# EAGLE design RFID-ArduinoBreakoutBoard (EAGLE 7.1.0)
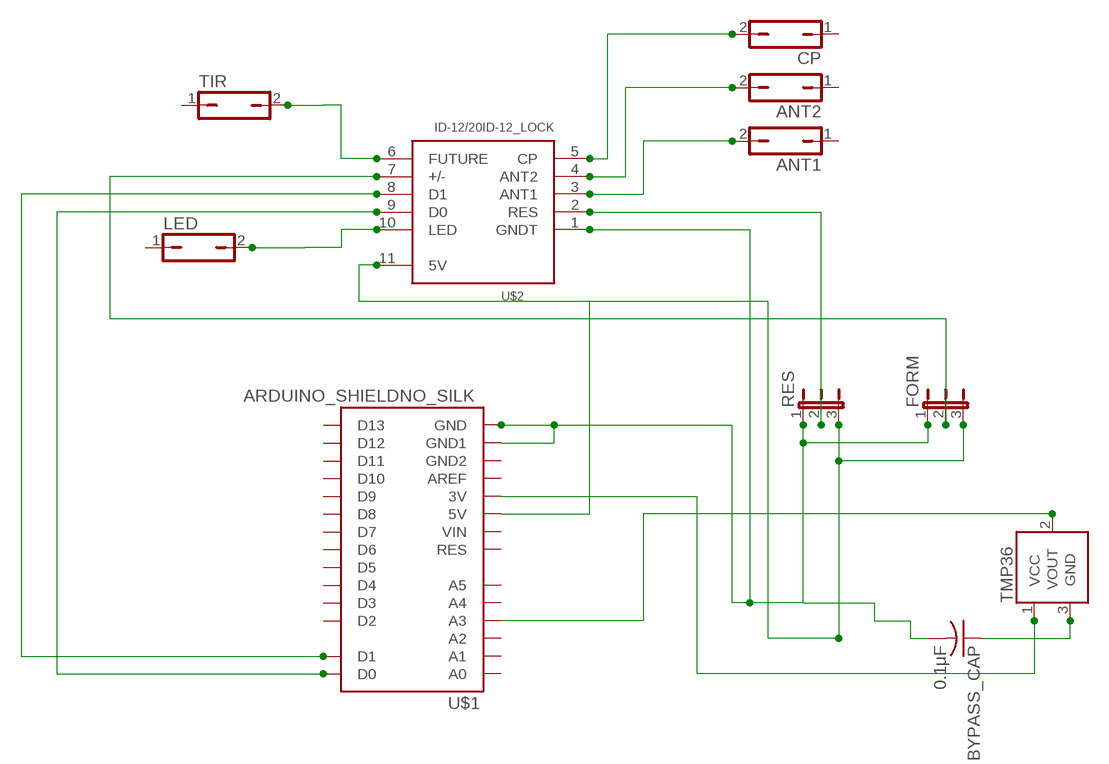
[diagram p0: schematic, sheet 1]

## Parts
ANT1  JP1Q  [JP1]
ANT2  JP1Q  [JP1]
BYPASS_CAP  0.1μF  C-USC0805  [C0805]
CP  JP1Q  [JP1]
FORM  JP2W  [JP2W]
LED  JP1Q  [JP1]
RES  JP2W  [JP2W]
TIR  JP1Q  [JP1]
TMP36  TMP36GT9  [TO-92]
U$1  ARDUINO_SHIELDNO_SILK  [DUEMILANOVE_VIAS]
U$2  ID-12/20ID-12_LOCK  [ID-12_LOCK]

## Nets
5V: FORM.3 RES.3 U$1.5V U$2.11(5V)
D0: U$1.D0 U$2.9(D0)
GND: BYPASS_CAP.2 FORM.1 RES.1 U$1.GND U$1.GND1 U$2.1(GNDT)
N$1: TMP36.2(VOUT) U$1.A3
N$2: U$1.D1 U$2.8(D1)
N$3: TMP36.1(VCC) U$1.3.3V(3V)
N$4: BYPASS_CAP.1 TMP36.3(GND)
RFID_ANT1: ANT1.2 U$2.3(ANT1)
RFID_ANT2: ANT2.2 U$2.4(ANT2)
RFID_CP: CP.2 U$2.5(CP)
RFID_FORM: FORM.2 U$2.7(+/-)
RFID_FUTURE: TIR.2 U$2.6(FUTURE)
RFID_LED: LED.2 U$2.10(LED)
RFID_RESET: RES.2 U$2.2(RES)
Unconnected: ANT1.1 ANT2.1 CP.1 LED.1 TIR.1 U$1.A0 U$1.A1 U$1.A2 U$1.A4 U$1.A5 U$1.AREF U$1.D2 U$1.D3 U$1.D4 U$1.D5 U$1.D6 U$1.D7 U$1.D8 U$1.D9 U$1.D10 U$1.D11 U$1.D12 U$1.D13 U$1.GND2 U$1.RES U$1.VIN

## Library data of the parts
ANT1 ANT2 CP LED TIR = ausbla01:JP1Q: JUMPER
BYPASS_CAP = resistor:C-US: CAPACITOR, American symbol
FORM RES = jumper:JP2W: JUMPER
TMP36 = SparkFun-Sensors:TMP36: Precision degC temp sensor, analog out
U$1 = SparkFun-Boards:ARDUINO_SHIELD: Arduino shield footprint
U$2 = SparkFun-RF:ID-12/20: RFID reader for ID2, ID12, and ID20 Package

## Board
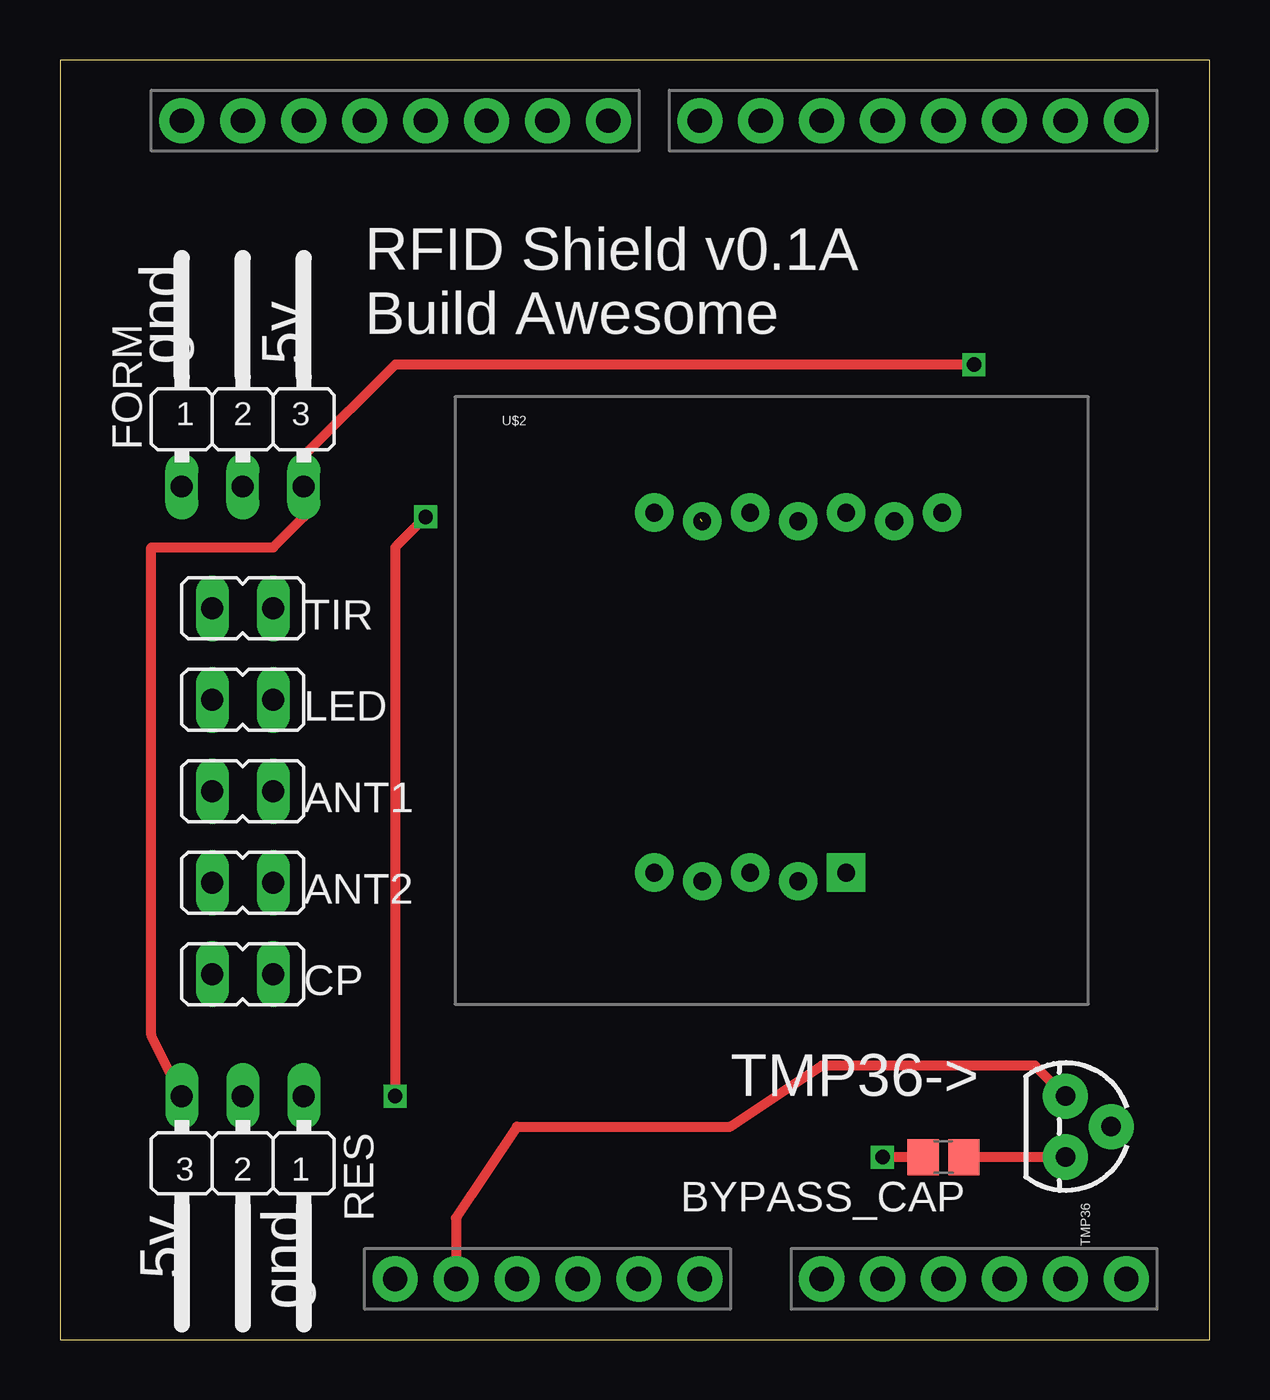
[diagram p1: board, top side]
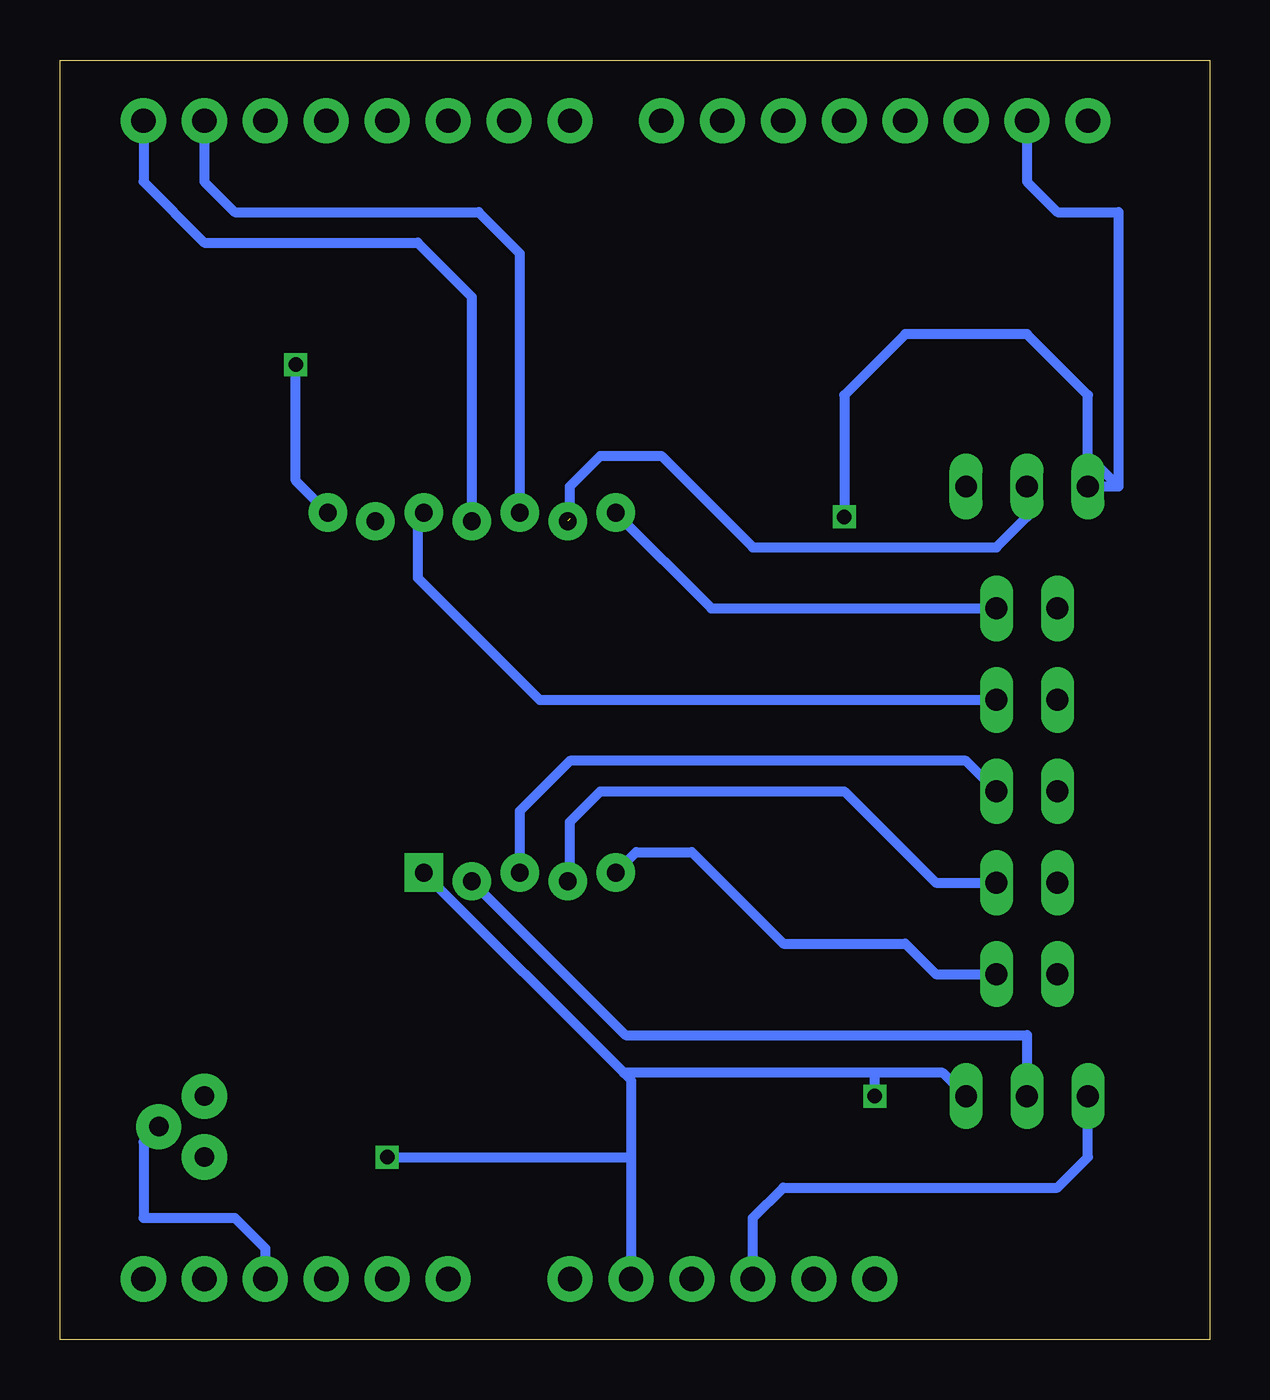
[diagram p2: board, bottom side, seen from below]

Size 47.93 x 53.33 mm. Coordinates in mm from the lower left corner, seen from the top.
Outline: 0,0 47.93,0 47.93,53.33 0,53.33 0,0
Copper layers (1*16): Top 0.0356mm / dielectric 1.5011mm / Bottom 0.0356mm
Design rules "OshParkDRU": minimum track width 6mil, minimum drill 13mil, track to track 6mil, track to pad 6mil, pad to pad 6mil, via to via 6mil, smd to smd 6mil, copper to edge 15mil, drill to drill 6mil, minimum pad ring 7mil, minimum via ring 7mil, stop-mask expansion 3mil, vias tented up to drill 0mil, thermal gap 10mil

### Footprints (pad centres in the part's own frame; a part is rotated, then mirrored left to right if it is on the bottom)
JP1 = drill 0.914 long: 1 0,-1.27; 2 0,1.27
C0805 = smd 1.3 x 1.5: 1 -0.85,0; 2 0.85,0
JP2W = drill 0.914 long: 1 -2.54,-1.27; 2 0,-1.27; 3 2.54,-1.27
TO-92 = drill 0.813 pad 1.88: 1 -1.27,0; 2 0,1.905; 3 1.27,0
DUEMILANOVE_VIAS = drill 1.016 pad 1.88: 3.3V 50.8,13.97; 5V 50.8,16.51; A0 50.8,29.21; A1 50.8,31.75; A2 50.8,34.29; A3 50.8,36.83; A4 50.8,39.37; A5 50.8,41.91; AREF 2.54,2.54; D0 2.54,41.91; D1 2.54,39.37; D2 2.54,36.83; D3 2.54,34.29; D4 2.54,31.75; D5 2.54,29.21; D6 2.54,26.67; D7 2.54,24.13; D8 2.54,20.32; D9 2.54,17.78; D10 2.54,15.24; D11 2.54,12.7; D12 2.54,10.16; D13 2.54,7.62; GND 2.54,5.08; GND1 50.8,21.59; GND2 50.8,19.05; RES 50.8,11.43; VIN 50.8,24.13
ID-12_LOCK = drill 0.737 pad 1.6 square: 1 16.255,5.498 | drill 0.737 pad 1.6: 2 14.255,5.142; 3 12.255,5.498; 4 10.255,5.142; 5 8.255,5.498; 6 8.255,20.498; 7 10.255,20.142; 8 12.255,20.498; 9 14.255,20.142; 10 16.255,20.498; 11 20.255,20.498; NC 18.268,20.142

### Placement (x,y rotation side)
ANT1  7.62,22.86 270 top
ANT2  7.62,19.05 270 top
BYPASS_CAP  36.83,7.62 180 top
CP  7.62,15.24 270 top
FORM  7.62,36.83 0 top
LED  7.62,26.67 270 top
RES  7.62,8.89 180 top
TIR  7.62,30.48 270 top
TMP36  41.91,8.89 270 top
U$1  2.54,53.34 270 top
U$2  16.51,13.97 0 top

### Tracks (layer width: path | path; a pad name or v marks a point on that pad's centre or on a via)
5V  (via drill 0.6)
  Top 0.406: RES.3 3.81,12.7 3.81,33.02 8.89,33.02 10.16,34.29 FORM.3 10.16,36.83 13.97,40.64 v38.1,40.64
  Bottom 0.406: U$1.5V 19.05,5.08 17.78,6.35 6.35,6.35 5.08,7.62 RES.3 | U$2.11 38.1,35.8 v38.1,40.64
D0
  Bottom 0.406: U$1.D0 44.45,48.26 41.91,45.72 33.02,45.72 30.76,43.46 U$2.9
GND  (via drill 0.6)
  Top 0.406: v15.24,34.29 13.97,33.02 v13.97,10.16 | BYPASS_CAP.2 v34.29,7.62
  Bottom 0.406: U$2.1 24.43,11.13 | 24.43,11.13 24.13,10.83 24.13,7.62 | 24.13,7.62 U$1.GND1 | RES.1 11.13,11.13 13.97,11.13 | 13.97,11.13 24.43,11.13 | 3.81,35.56 3.81,44.45 3.81,45.72 3.81,46.99 6.35,46.99 7.62,48.26 U$1.GND | FORM.1 3.81,35.56 | 3.81,35.56 5.08,36.83 5.08,39.37 7.62,41.91 12.7,41.91 15.24,39.37 v15.24,34.29 | v13.97,10.16 13.97,11.13 | v34.29,7.62 24.13,7.62
N$1
  Bottom 0.406: TMP36.2 44.45,8.26 44.45,5.08 40.64,5.08 39.37,3.81 U$1.A3
N$2
  Bottom 0.406: U$1.D1 41.91,48.26 40.64,46.99 30.48,46.99 28.76,45.27 U$2.8
N$3
  Top 0.406: U$1.3.3V 16.51,5.08 19.05,8.89 27.94,8.89 31.75,11.43 40.64,11.43 TMP36.1
N$4
  Top 0.406: TMP36.3 BYPASS_CAP.1
RFID_ANT1
  Bottom 0.406: ANT1.2 10.16,24.13 26.67,24.13 28.76,22.03 U$2.3
RFID_ANT2
  Bottom 0.406: U$2.4 26.67,19.21 26.67,21.59 25.4,22.86 15.24,22.86 11.43,19.05 ANT2.2
RFID_CP
  Bottom 0.406: U$2.5 23.91,20.32 21.59,20.32 17.78,16.51 12.7,16.51 11.43,15.24 CP.2
RFID_FORM  (1 unrouted)
  Bottom 0.406: 26.67,34.21 26.67,35.56 25.4,36.83 22.86,36.83 19.05,33.02 8.89,33.02 7.62,34.29 FORM.2
RFID_FUTURE
  Bottom 0.406: U$2.6 20.78,30.48 TIR.2
RFID_LED
  Bottom 0.406: U$2.10 33.02,34.21 33.02,31.75 27.94,26.67 LED.2
RFID_RESET
  Bottom 0.406: U$2.2 24.35,12.7 7.62,12.7 RES.2

### Text on the board
tNames: RFID Shield v0.1A / Build Awesome
tSilk: gnd | 5v | TMP36-> | 5v | gnd